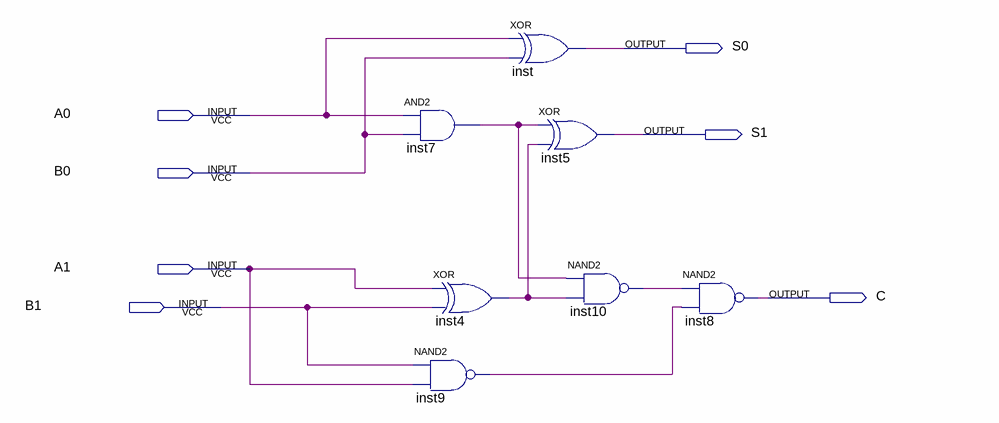
[diagram p0: schematic sheet]
// Quartus schematic test2.bdf as structural Verilog: 7 symbols, 7 pins
module test2 (
  input  A0,
  input  B0,
  input  A1,
  input  B1,
  output S0,
  output S1,
  output C
);

  wire inst4_out, inst7_out, inst9_out, inst10_out;

  and inst7 (inst7_out, A0, B0);
  xor inst4 (inst4_out, A1, B1);
  nand inst9 (inst9_out, B1, A1);
  xor inst (S0, A0, B0);
  xor inst5 (S1, inst7_out, inst4_out);
  nand inst10 (inst10_out, inst7_out, inst4_out);
  nand inst8 (C, inst10_out, inst9_out);
endmodule
